# EAGLE design mod-69 (EAGLE 9.6.1)
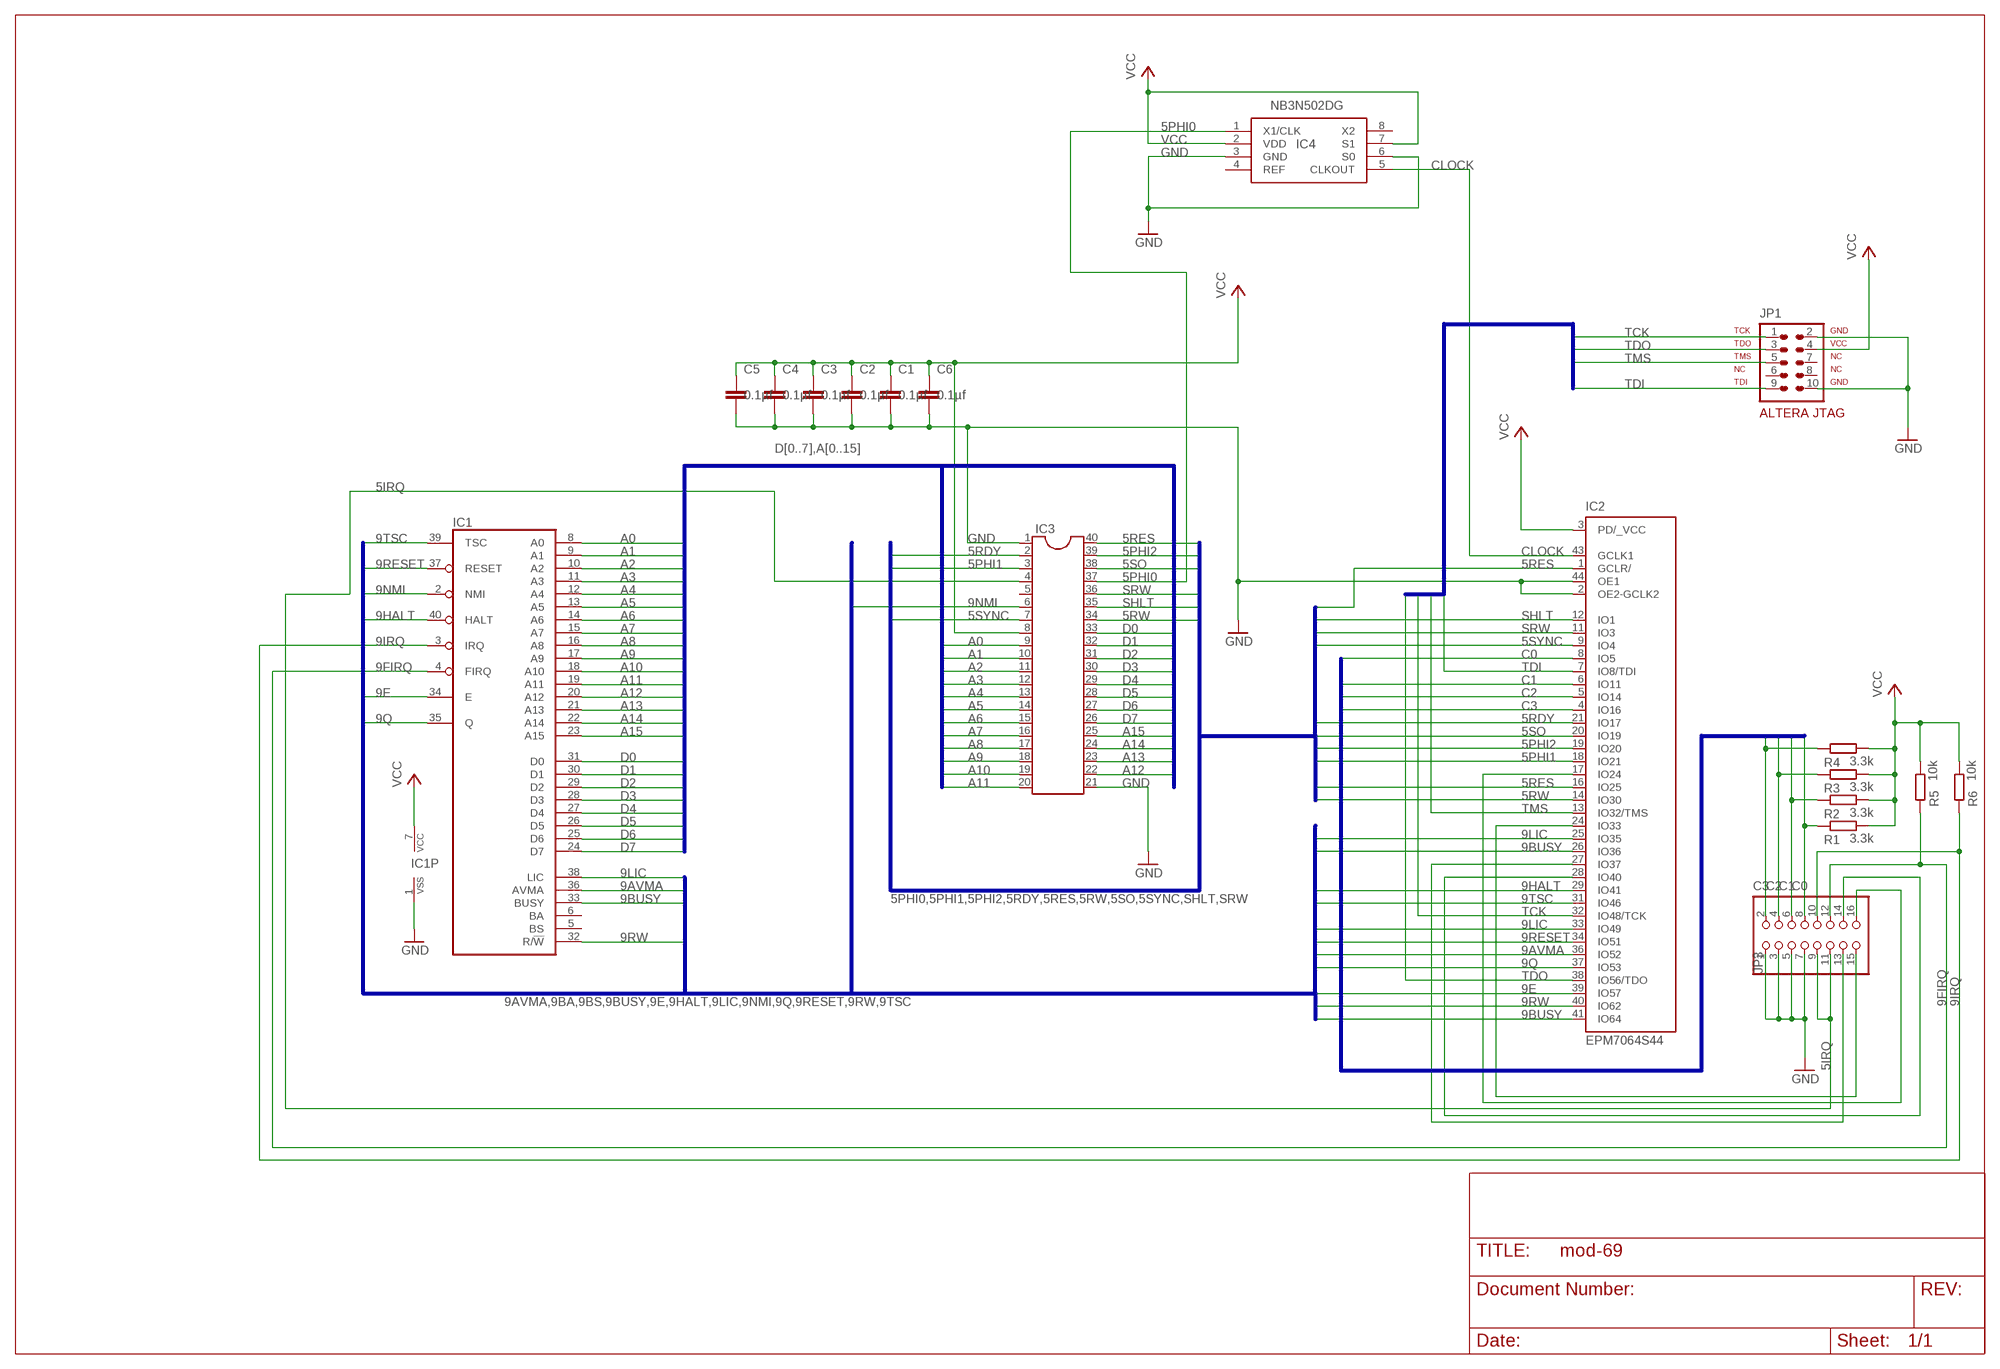
[diagram p0: schematic, sheet 1]

## Parts
C1  0.1µf  C-EUC1206  [C1206]
C2  0.1µf  C-EUC1206  [C1206]
C3  0.1µf  C-EUC1206  [C1206]
C4  0.1µf  C-EUC1206  [C1206]
C5  0.1µf  C-EUC1206  [C1206]
C6  0.1µf  C-EUC1206  [C1206]
IC1  6809E  [DIL40]
IC2  EPM7064S44  [PLCC-S44]
IC3  DIL40  [DIL40]
IC4  NB3N502DG  [SOIC127P600X175-8N]
JP1  ALTERA-JTAG-10  [ALTERA-JTAG-10]
JP3  PINHD-2X8  [2X08]
R1  3.3k  R-EU_M1206  [M1206]
R2  3.3k  R-EU_M1206  [M1206]
R3  3.3k  R-EU_M1206  [M1206]
R4  3.3k  R-EU_M1206  [M1206]
R5  10k  R-EU_M1206  [M1206]
R6  10k  R-EU_M1206  [M1206]

## Nets
5IRQ: IC3.4 JP3.9 JP3.11
5PHI0: IC3.37 IC4.1(X1/CLK)
5PHI1: IC2.18(IO21) IC3.3
5PHI2: IC2.19(IO20) IC3.39
5RDY [GND]: IC2.21(IO17) IC3.2
5RES: IC2.1(GCLR/) IC2.16(IO25) IC3.40
5RW: IC2.14(IO30) IC3.34
5SO: IC2.20(IO19) IC3.38
5SYNC: IC2.9(IO4) IC3.7
9AVMA: IC1.36(AVMA) IC2.36(IO52)
9BUSY: IC1.33(BUSY) IC2.26(IO36) IC2.41(IO64)
9E: IC1.34(E) IC2.39(IO57)
9FIRQ: IC1.4(FIRQ) JP3.12 R5.1
9HALT: IC1.40(HALT) IC2.29(IO41)
9IRQ: IC1.3(IRQ) JP3.10 R6.1
9LIC: IC1.38(LIC) IC2.25(IO35) IC2.33(IO49)
9NMI: IC1.2(NMI) IC3.6
9Q: IC1.35(Q) IC2.37(IO53)
9RESET: IC1.37(RESET) IC2.34(IO51)
9RW: IC1.32(R/!W) IC2.40(IO62)
9TSC: IC1.39(TSC) IC2.31(IO46)
A0: IC1.8(A0) IC3.9
A1: IC1.9(A1) IC3.10
A2: IC1.10(A2) IC3.11
A3: IC1.11(A3) IC3.12
A4: IC1.12(A4) IC3.13
A5: IC1.13(A5) IC3.14
A6: IC1.14(A6) IC3.15
A7: IC1.15(A7) IC3.16
A8: IC1.16(A8) IC3.17
A9: IC1.17(A9) IC3.18
A10: IC1.18(A10) IC3.19
A11: IC1.19(A11) IC3.20
A12: IC1.20(A12) IC3.22
A13: IC1.21(A13) IC3.23
A14: IC1.22(A14) IC3.24
A15: IC1.23(A15) IC3.25
C0: IC2.8(IO5) JP3.8 R1.1
C1: IC2.6(IO11) JP3.6 R2.1
C2: IC2.5(IO14) JP3.4 R3.1
C3: IC2.4(IO16) JP3.2 R4.1
CLOCK: IC2.43(GCLK1) IC4.5(CLKOUT)
D0: IC1.31(D0) IC3.33
D1: IC1.30(D1) IC3.32
D2: IC1.29(D2) IC3.31
D3: IC1.28(D3) IC3.30
D4: IC1.27(D4) IC3.29
D5: IC1.26(D5) IC3.28
D6: IC1.25(D6) IC3.27
D7: IC1.24(D7) IC3.26
GND [GND]: C1.2 C2.2 C3.2 C4.2 C5.2 C6.2 IC1.1(VSS) IC2.2(OE2-GCLK2) IC2.44(OE1) IC3.1 IC3.21 IC4.3(GND) IC4.6(S0) JP1.2(GND1) JP1.10(GND2) JP3.1 JP3.3 JP3.5 JP3.7
N$1: IC2.27(IO37) JP3.13
N$2: IC2.28(IO40) JP3.14
N$3: IC2.24(IO33) JP3.15
N$4: IC2.17(IO24) JP3.16
SHLT: IC2.12(IO1) IC3.35
SRW: IC2.11(IO3) IC3.36
TCK: IC2.32(IO48/TCK) JP1.1(TCK)
TDI: IC2.7(IO8/TDI) JP1.9(TDI)
TDO: IC2.38(IO56/TDO) JP1.3(TDO)
TMS: IC2.13(IO32/TMS) JP1.5(TMS)
VCC [PWR]: C1.1 C2.1 C3.1 C4.1 C5.1 C6.1 IC1.7(VCC) IC2.3(PD/_VCC) IC3.8 IC4.2(VDD) IC4.7(S1) JP1.4(VCC) R1.2 R2.2 R3.2 R4.2 R5.2 R6.2
Unconnected: IC1.5(BS) IC1.6(BA) IC3.5 IC4.4(REF) IC4.8(X2) JP1.6(NC1) JP1.7(NC2) JP1.8(NC3)

## Buses
D[0..7],A[0..15]
9AVMA,9BA,9BS,9BUSY,9E,9HALT,9LIC,9NMI,9Q,9RESET,9RW,9TSC
5PHI0,5PHI1,5PHI2,5RDY,5RES,5RW,5SO,5SYNC,SHLT,SRW
TDI,TDO,TMS,TCK
C[0..3]

## Power pins joined to a net without a drawn wire
GND: IC2.10(GND) IC2.22(GND) IC2.30(GND) IC2.42(GND)
VCC: IC2.15(VCC) IC2.23(VCC) IC2.35(VCC)

## Library data of the parts
C1-C6 = rcl:C-EU: CAPACITOR, European symbol; SPICEPREFIX: C
IC1 = micro-motorola:6809E: MICROCONTROLLER/MEMORY DEVICE; MF: NTE ELECTRONICS; MPN: NTE6809E; OC_FARNELL: unknown; OC_NEWARK: 31C5318
IC2 = altera:EPM7064: EPM7064 MAX 7000 family; MPN: EPM7064SLC44-10N; OC_FARNELL: 1549449; OC_NEWARK: 51R0526
IC3 = ic-package:DIL40: Dual In Line
IC4 = custom-chips:NB3N502DG: Source: Datasheet <http://www.onsemi.com/pub/Collateral/NB3N502-D.PDF>; ALLIED_NUMBER: 70347799; ALLIED_PRICE-STOCK: http://www.alliedelec.com/on-semiconductor-nb3n502dg/70347799/; HEIGHT: 1.75mm; MANUFACTURER_NAME: ON Semiconductor; MANUFACTURER_PART_NUMBER: NB3N502DG; MOUSER_PART_NUMBER: 863-NB3N502DG; MOUSER_PRICE-STOCK: https://www.mouser.com/Search/Refine.aspx?Keyword=863-NB3N502DG; RS_PART_NUMBER: 7876920P; RS_PRICE-STOCK: http://uk.rs-online.com/web/p/products/7876920P
JP1 = custom-chips:ALTERA-JTAG-10: ALTERA JTAG JTAGl Programming Header
JP3 = pinhead:PINHD-2X8: PIN HEADER
R1-R6 = rcl:R-EU_: RESISTOR, European symbol; SPICEPREFIX: R

## Net classes
0 default: width 0.152 mm, clearance 0.152 mm
1 PWR: width 0.305 mm, clearance 0.152 mm
2 GND: width 0.406 mm, clearance 0.152 mm

## Board
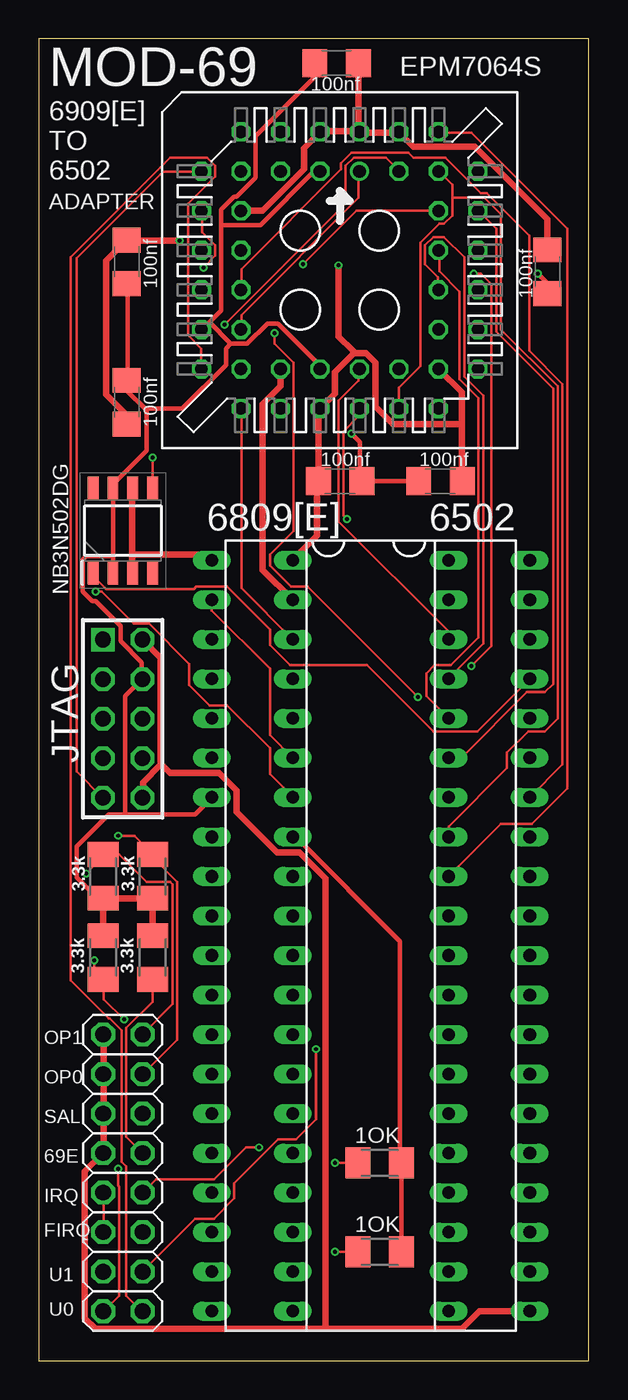
[diagram p1: board, top side]
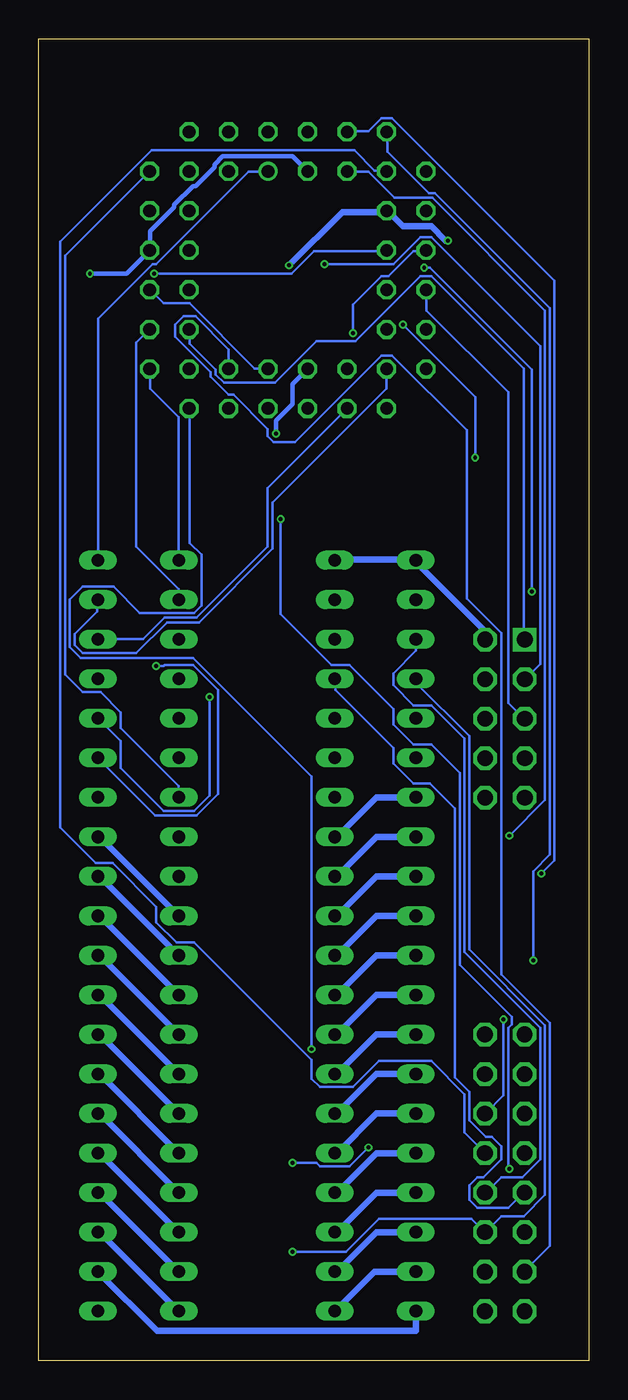
[diagram p2: board, bottom side, seen from below]

Size 35.35 x 84.94 mm. Coordinates in mm from the lower left corner, seen from the top.
Outline: 0,0 35.35,0 35.35,84.94 0,84.94 0,0
Copper layers (1*16): Top 0.035559375mm / dielectric 1.6mm / Bottom 0.035559375mm
Design rules "oshpark-2layer": minimum track width 6mil, minimum drill 10mil, track to track 6mil, track to pad 6mil, pad to pad 6mil, via to via 6mil, smd to smd 6mil, copper to edge 15mil, drill to drill 6mil, minimum pad ring 5mil, minimum via ring 5mil, stop-mask expansion 2.5mil, vias tented up to drill 0mil, thermal gap 10mil

### Footprints (pad centres in the part's own frame; a part is rotated, then mirrored left to right if it is on the bottom)
C1206 = smd 1.6 x 1.8: 1 -1.4,0; 2 1.4,0
DIL40 = drill 0.813 long: 1 -24.13,-7.62; 2 -21.59,-7.62; 3 -19.05,-7.62; 4 -16.51,-7.62; 5 -13.97,-7.62; 6 -11.43,-7.62; 7 -8.89,-7.62; 8 -6.35,-7.62; 9 -3.81,-7.62; 10 -1.27,-7.62; 11 1.27,-7.62; 12 3.81,-7.62; 13 6.35,-7.62; 14 8.89,-7.62; 15 11.43,-7.62; 16 13.97,-7.62; 17 16.51,-7.62; 18 19.05,-7.62; 19 21.59,-7.62; 20 24.13,-7.62; 21 24.13,7.62; 22 21.59,7.62; 23 19.05,7.62; 24 16.51,7.62; 25 13.97,7.62; 26 11.43,7.62; 27 8.89,7.62; 28 6.35,7.62; 29 3.81,7.62; 30 1.27,7.62; 31 -1.27,7.62; 32 -3.81,7.62; 33 -6.35,7.62; 34 -8.89,7.62; 35 -11.43,7.62; 36 -13.97,7.62; 37 -16.51,7.62; 38 -19.05,7.62; 39 -21.59,7.62; 40 -24.13,7.62
PLCC-S44 = drill 0.813: 1 1.27,6.35 | drill 0.813 octagon: 2 -1.27,8.89; 3 -1.27,6.35; 4 -3.81,8.89; 5 -3.81,6.35; 6 -6.35,8.89; 7 -8.89,6.35; 8 -6.35,6.35; 9 -8.89,3.81; 10 -6.35,3.81; 11 -8.89,1.27; 12 -6.35,1.27; 13 -8.89,-1.27; 14 -6.35,-1.27; 15 -8.89,-3.81; 16 -6.35,-3.81; 17 -8.89,-6.35; 18 -6.35,-8.89; 19 -6.35,-6.35; 20 -3.81,-8.89; 21 -3.81,-6.35; 22 -1.27,-8.89; 23 -1.27,-6.35; 24 1.27,-8.89; 25 1.27,-6.35; 26 3.81,-8.89; 27 3.81,-6.35; 28 6.35,-8.89; 29 8.89,-6.35; 30 6.35,-6.35; 31 8.89,-3.81; 32 6.35,-3.81; 33 8.89,-1.27; 34 6.35,-1.27; 35 8.89,1.27; 36 6.35,1.27; 37 8.89,3.81; 38 6.35,3.81; 39 8.89,6.35; 40 6.35,8.89; 41 6.35,6.35; 42 3.81,8.89; 43 3.81,6.35; 44 1.27,8.89
SOIC127P600X175-8N = smd 1.525 x 0.7: 1 -2.712,1.905; 2 -2.712,0.635; 3 -2.712,-0.635; 4 -2.712,-1.905; 5 2.712,-1.905; 6 2.712,-0.635; 7 2.712,0.635; 8 2.712,1.905
ALTERA-JTAG-10 = drill 1.016 square: 1 -5.08,-1.27 | drill 1.016 octagon: 2 -5.08,1.27; 3 -2.54,-1.27; 4 -2.54,1.27; 5 0,-1.27; 6 0,1.27; 7 2.54,-1.27; 8 2.54,1.27; 9 5.08,-1.27; 10 5.08,1.27
2X08 = drill 1.016 octagon: 1 -8.89,-1.27; 2 -8.89,1.27; 3 -6.35,-1.27; 4 -6.35,1.27; 5 -3.81,-1.27; 6 -3.81,1.27; 7 -1.27,-1.27; 8 -1.27,1.27; 9 1.27,-1.27; 10 1.27,1.27; 11 3.81,-1.27; 12 3.81,1.27; 13 6.35,-1.27; 14 6.35,1.27; 15 8.89,-1.27; 16 8.89,1.27
M1206 = smd 1.6 x 2: 1 -1.4,0; 2 1.4,0

### Placement (x,y rotation side)
C1  5.65,70.61 90 top
C2  32.7,69.98 90 top
C3  19.37,56.52 180 top
C4  19.14,83.39 0 top
C5  25.82,56.52 0 top
C6  5.65,61.59 270 top
IC1  18.73,27.3 270 top
IC2  19.34,70.08 0 top
IC3  23.94,27.3 270 top
IC4  5.4,53.34 90 top
JP1  5.38,41.25 270 top
JP3  5.4,12.06 270 top
R1  7.3,25.91 90 top
R2  4.13,25.91 90 top
R3  7.3,31.12 270 top
R4  4.13,31.12 270 top
R5  21.91,6.99 0 top
R6  21.91,12.7 0 top

### Tracks (layer width: path | path; a pad name or v marks a point on that pad's centre or on a via)
5IRQ
  Top 0.152: JP3.11 4.18,8.28 4.18,10.79 JP3.9
  Bottom 0.152: IC3.4 16.29,43.79 16.29,43.1 12.56,39.37 12.56,38.38 11.26,37.08 10.2,37.08 8.6,35.48 8.6,18.19 7.68,17.27 7.68,15.44 6.62,14.38 6.24,14.38 5.63,13.77 5.63,12.93 6.77,11.79 7.15,11.79 7.68,11.25 7.68,10.34 7.15,9.8 5.17,9.8 4.18,10.79 JP3.9
5PHI0
  Top 0.152: IC4.1 3.49,50.42 4.33,49.58 9.97,49.58 10.12,49.73 12.1,49.73 14.85,46.99 14.85,46 16.14,44.7 21.09,44.7 25.36,40.44 28.18,40.44 IC3.37
5PHI1
  Top 0.152: IC3.3 13.02,49.66 13.02,61.16 IC2.18
5PHI2
  Bottom 0.152: IC3.39 31.61,48.9 31.61,48.13 33.06,46.69 33.06,46 32.52,45.47 29.1,45.47 27.11,47.45 25.06,47.45 20.33,52.17 20.33,55.14 13.02,62.46 13.02,63.68 IC2.19
5RDY
  Top 0.406: IC2.21 15.53,62.61 14.39,61.47 14.39,50.8 16.29,48.9 IC3.2
5RES
  Top 0.152: IC2.16 13.02,66.27 13.02,67.18 20.56,74.73 20.56,76.4 IC2.1
  Bottom 0.152: IC3.40 31.53,51.49 31.53,66.95 28.03,70.46 27.8,70.46 21.86,76.4 20.64,76.4 IC2.1
5RW
  Top 0.152: IC3.34 33.67,38.3 33.67,62.76 31.53,64.9 31.53,72.29 28.79,75.03 28.41,75.03 26.12,77.32 24.07,77.32 23.76,77.62 20.1,77.62 19.42,76.94 19.42,76.56 13.02,70.16 13.02,68.86 IC2.14
5SO
  Bottom 0.152: IC3.38 31.53,46.38 28.64,46.38 27.27,47.75 25.21,47.75 20.64,52.32 20.64,56.06 15.53,61.16 IC2.20
5SYNC  (via drill 0.25)
  Top 0.152: v10.58,70.23 11.34,70.99 11.34,71.68 10.5,72.52 10.5,73.89 IC2.9 | v3.64,49.43 4.03,49.43 6.08,47.37 7.07,47.37 9.66,44.78 9.66,43.41 10.96,42.11 12.1,42.11 14.85,39.37 14.85,37.69 16.29,36.25 IC3.7
  Bottom 0.152: v10.58,70.23 10.2,70.23 3.64,63.68 v3.64,49.43
9AVMA
  Top 0.152: IC1.36 24.9,42.72 24.9,44.17 25.44,44.7 26.5,44.7 28.26,46.46 28.26,61.85 27.04,63.07 27.04,68.71 25.74,70 25.74,71.3 IC2.36
9BUSY
  Top 0.152: IC2.26 23.15,62.53 24.52,63.91 24.52,71.83 25.74,73.05 26.05,73.05 26.58,73.58 26.58,74.73 | 26.58,74.73 26.58,75.56 25.74,76.4 IC2.41 | IC1.33 26.35,34.34 30.09,38.08 30.09,39.07 31.46,40.44 32.52,40.44 33.36,41.28 33.36,62.61 29.71,66.27 29.71,73.66 28.64,74.73 26.58,74.73
9E
  Bottom 0.152: IC1.34 26.35,36.93 30.09,40.66 30.09,41.66 31.38,42.95 32.52,42.95 33.67,44.09 33.67,70.99 IC2.39
9FIRQ  (via drill 0.25)
  Top 0.152: v19.04,6.99 R5.1
  Bottom 0.152: IC1.4 11.11,43.56 7.68,40.13 7.68,26.42 2.81,21.54 2.81,10.64 4.18,9.27 5.63,9.27 6.62,8.28 JP3.12 7.53,9.12 13.47,9.12 15.61,6.99 v19.04,6.99
9HALT
  Bottom 0.152: IC1.40 26.35,60.63 28.18,62.46 28.18,63.68 IC2.29
9IRQ  (via drill 0.25)
  Top 0.152: v19.04,12.7 R6.1 | v14.16,13.69 13.32,13.69 11.26,11.63 7.53,11.63 6.69,10.79 JP3.10
  Bottom 0.152: IC1.3 11.11,45.62 12.56,44.17 12.56,43.41 11.26,42.11 10.12,42.11 7.99,39.98 7.99,26.26 3.11,21.39 3.11,12.93 4.25,11.79 5.63,11.79 6.62,10.79 JP3.10 | v19.04,12.7 17.51,12.7 17.28,12.47 15.38,12.47 v14.16,13.69
9LIC
  Top 0.152: IC1.38 26.35,46.84 19.27,53.92 19.27,61.7 20.56,62.99 20.56,63.68 IC2.25
  Bottom 0.152: IC2.25 20.64,63.75 21.48,63.75 25.67,67.95 27.34,67.95 28.18,68.78 IC2.33
9NMI
  Top 0.152: IC1.2 11.11,48.21 14.85,44.48 14.85,40.21 IC3.6
9Q
  Top 0.152: IC1.35 26.35,38.76 27.19,38.76 31.38,42.95 32.52,42.95 33.06,43.48 33.06,62.46 29.4,66.12 29.4,72.75 28.26,73.89 IC2.37
9RESET
  Top 0.152: IC2.34 25.67,68.86 25.67,69.62 24.83,70.46 24.83,71.68 25.36,72.21 26.05,72.21 27.34,70.92 27.34,63.22 28.56,62 28.56,46.08 26.35,43.87 IC1.37
9RW
  Top 0.152: IC2.40 25.74,78.92 27.8,78.92 33.97,72.75 33.97,36.78 31.69,34.49 29.71,34.49 26.35,31.14 IC1.32
9TSC
  Bottom 0.152: IC1.39 26.35,49.58 29.1,52.32 29.1,65.43 28.26,66.27 IC2.31
A0
  Bottom 0.406: IC3.9 16.19,31.12 13.65,33.66 IC1.8
A1
  Bottom 0.406: IC3.10 16.19,28.58 13.65,31.12 IC1.9
A2
  Bottom 0.406: IC3.11 16.19,26.04 13.65,28.58 IC1.10
A3
  Bottom 0.406: IC3.12 16.19,23.5 13.65,26.04 IC1.11
A4
  Bottom 0.406: IC3.13 16.19,20.96 13.65,23.5 IC1.12
A5
  Bottom 0.406: IC3.14 16.19,18.41 13.65,20.96 IC1.13
A6
  Bottom 0.406: IC3.15 16.19,15.88 13.65,18.41 IC1.14
A7
  Bottom 0.406: IC3.16 16.19,13.33 13.65,15.88 IC1.15
A8
  Bottom 0.406: IC3.17 16.19,10.79 13.65,13.33 IC1.16
A9
  Bottom 0.406: IC3.18 16.19,8.26 13.65,10.79 IC1.17
A10
  Bottom 0.406: IC3.19 16.19,5.72 13.65,8.26 IC1.18
A11
  Bottom 0.406: IC3.20 13.78,5.72 IC1.19
A12
  Bottom 0.406: IC1.20 11.11,1.91 27.75,1.91 IC3.22
A13
  Bottom 0.406: IC1.21 31.43,8.26 IC3.23
A14
  Bottom 0.406: IC1.22 31.43,10.79 IC3.24
A15
  Bottom 0.406: IC1.23 31.43,13.33 IC3.25
C0
  Top 0.152: R1.1 7.3,23.06 5.63,21.39 5.63,14.38 JP3.8
  Bottom 0.152: IC2.8 13.02,76.48 13.78,76.48 15.07,77.78 28.11,77.78 33.97,71.91 33.97,34.27 31.69,31.98 30.62,31.98 27.8,29.16 27.8,28.17 26.5,26.87 25.36,26.87 17.82,19.33 17.82,18.11 17.28,17.58 15.15,17.58 13.47,19.25 10.12,19.25 7.99,17.12 7.99,14.68 6.69,13.39 JP3.8
C1  (via drill 0.25)
  Top 0.152: v5.47,21.92 4.18,23.22 4.18,24.44 R2.1 4.1,24.51 3.57,25.04 v3.57,25.73
  Bottom 0.152: v5.47,21.92 5.47,17.04 6.62,15.9 JP3.6 | v3.57,25.73 3.57,31.45 2.5,32.51 2.5,67.64 9.89,75.03 10.27,75.03 12.94,77.7 12.94,78.92 IC2.6
C2  (via drill 0.25)
  Top 0.152: JP3.4 6.69,18.41 8.9,20.62 8.9,30.76 7.3,32.36 R3.1 7.3,32.59 6.16,33.73 v5.09,33.73
  Bottom 0.152: v5.09,33.73 2.81,36.02 2.81,67.49 10.05,74.73 12.48,74.73 14.16,76.4 15.53,76.4 IC2.5
C3  (via drill 0.25)
  Top 0.152: JP3.2 6.69,21.01 8.6,22.91 8.6,30.61 8.45,30.76 6.92,30.76 5.17,32.51 4.18,32.51 R4.1 4.18,32.44 v3.04,31.29
  Bottom 0.152: v3.04,31.29 2.2,32.13 2.2,69.39 12.64,79.83 13.32,79.83 14.16,78.99 15.53,78.99 IC2.4
CLOCK  (via drill 0.25)
  Top 0.152: v7.3,58.04 IC4.5 | v11.95,66.57 19.72,74.35 19.72,76.78 20.26,77.32 22.31,77.32 23.15,76.48 IC2.43
  Bottom 0.152: v7.3,58.04 7.3,61.92 v11.95,66.57
D0
  Bottom 0.406: IC1.31 31.43,33.66 IC3.33
D1
  Bottom 0.406: IC1.30 31.43,31.12 IC3.32
D2
  Bottom 0.406: IC1.29 31.43,28.58 IC3.31
D3
  Bottom 0.406: IC1.28 31.43,26.04 IC3.30
D4
  Bottom 0.406: IC1.27 31.43,23.5 IC3.29
D5
  Bottom 0.406: IC1.26 31.43,20.96 IC3.28
D6
  Bottom 0.406: IC1.25 31.43,18.41 IC3.27
D7
  Bottom 0.406: IC1.24 31.43,15.88 IC3.26
GND  (via drill 0.25)
  Top 0.406: C2.2 32.68,71.45 32.68,73.36 28.03,78 24.07,78 23.15,78.92 IC2.42 23,78.92 20.79,78.92 IC2.44 | C6.2 5.63,60.25 5.63,60.78 4.33,62.08 4.33,70.69 5.63,71.98 C1.2 5.85,71.98 v9.06,71.98 | C4.2 20.56,83.34 20.56,78.99 IC2.44 | IC2.10 14.39,73.89 17.06,76.56 17.06,77.93 18.05,78.92 IC2.2 18.28,78.99 20.41,78.99 IC2.44 | IC3.21 28.33,3.18 27.19,2.03 18.43,2.03 | 18.43,2.03 3.64,2.03 2.96,2.72 2.96,12.17 JP3.7 4.18,13.46 4.18,15.82 JP3.5 4.18,16.05 4.18,18.41 JP3.3 4.18,18.57 4.18,20.93 JP3.1 | 7.84,38.3 6.69,37.16 6.69,36.17 JP1.10 | 7.84,38.3 7.84,45.16 6.69,46.3 JP1.2 | 27.19,60.17 27.19,62.23 IC2.30 | 27.19,60.17 27.19,56.52 C5.2 | 6.01,51.79 6.01,55.98 IC4.6 | 6.01,51.79 6.01,50.65 IC4.3 | 6.01,51.79 10.81,51.79 11.11,51.49 IC1.1 | IC3.1 17.89,53.01 17.89,56.36 C3.2 17.97,61.09 IC2.22 19.04,62.15 19.04,63.53 20.26,64.75 | 27.19,60.17 22.77,60.17 21.63,61.32 21.63,64.14 21.02,64.75 20.26,64.75 | 18.43,2.03 18.43,30.99 16.75,32.66 15.3,32.66 12.71,35.26 12.71,36.63 11.57,37.77 8.45,37.77 7.99,38.23 7.84,38.3 | v19.27,70.38 19.27,65.81 20.18,64.9 20.26,64.75
  Bottom 0.406: v9.06,71.98 9.21,71.98 10.12,72.9 11.95,72.9 12.94,73.89 IC2.10 13.17,73.81 15.84,73.81 v19.27,70.38 | IC3.1 16.29,51.49 11.11,51.49 IC1.1 11.04,51.26 6.69,46.91 6.69,46.38 JP1.2
N$1
  Bottom 0.152: IC2.27 23.15,64.97 25.29,67.11 26.05,67.11 26.58,66.57 26.58,65.81 24.3,63.53 24.3,63.22 23.15,62.08 22.85,62.08 20.64,59.87 20.64,59.41 20.26,59.03 18.88,59.03 13.32,64.59 12.64,64.59 7.84,59.79 7.84,48.97 5.63,46.76 5.63,24.82 2.5,21.69 2.5,7.37 4.1,5.77 JP3.13
N$2  (via drill 0.25)
  Top 0.152: v17.82,20.02 17.82,15.52 16.52,14.22 15.38,14.22 12.56,11.4 12.56,10.41 11.26,9.12 10.05,9.12 6.69,5.77 JP3.14
  Bottom 0.152: v17.82,20.02 17.82,37.54 25.44,45.16 32.68,45.16 33.36,45.85 33.36,48.9 32.52,49.73 30.54,49.73 28.87,48.06 25.36,48.06 24.9,48.51 24.9,51.79 25.67,52.55 25.67,61.16 IC2.28
N$3  (via drill 0.25)
  Top 0.152: v19.8,54.08 19.57,54.31 19.57,59.72 20.56,60.71 20.56,61.16 IC2.24 | v5.09,12.32 5.09,11.25 5.17,11.18 5.17,4.17 4.18,3.18 JP3.15
  Bottom 0.152: v19.8,54.08 19.8,47.98 16.52,44.7 15.38,44.7 12.56,41.89 12.56,40.89 11.26,39.6 10.12,39.6 8.29,37.77 8.29,25.43 4.94,22.07 4.94,21.62 5.17,21.39 5.17,12.4 v5.09,12.32
N$4
  Top 0.152: IC2.17 10.43,63.75 10.43,65.05 9.59,65.89 9.59,74.35 11.34,76.1 11.34,76.78 10.81,77.32 8.45,77.32 2.04,70.92 2.04,24.44 4.48,22 4.56,22 5.32,21.23 5.32,12.78 5.63,12.47 5.63,4.17 6.62,3.18 JP3.16
SHLT  (via drill 0.25)
  Top 0.152: v27.95,69.85 28.41,69.85 29.1,69.16 29.1,45.92 v27.8,44.63
  Bottom 0.152: v27.95,69.85 19.11,69.85 17.67,71.3 13.02,71.3 IC2.12 | v27.8,44.63 27.34,44.63 27.27,44.7 25.44,44.7 23.84,43.1 23.84,36.4 25.21,35.03 27.88,35.03 31.53,38.68 IC3.35
SRW  (via drill 0.25)
  Top 0.152: v15.15,66.04 15.15,65.35 16.37,64.14 16.37,53.31 14.85,51.79 14.85,51.11 16.22,49.73 17.28,49.73 v24.37,42.65
  Bottom 0.152: v15.15,66.04 15.15,67.87 13.32,69.7 12.87,69.7 11.26,71.3 10.5,71.3 IC2.11 | v24.37,42.65 24.37,36.32 25.36,35.33 27.34,35.33 30.09,38.08 30.09,39.83 31.53,41.28 IC3.36
TCK
  Bottom 0.152: IC2.32 25.67,66.27 25.67,65.35 23.99,63.68 23.99,63.37 23.46,62.84 20.18,62.84 17.51,65.51 15,65.51 10.81,69.7 10.12,69.7 4.18,63.75 4.18,46.38 JP1.1
TDI
  Top 0.152: IC2.7 10.43,76.4 7.99,76.4 2.43,70.84 2.43,37.85 JP1.9
TDO  (via drill 0.25)
  Top 0.152: IC2.38 20.41,73.89 v16.98,70.46
  Bottom 0.152: v16.98,70.46 12.56,70.46 10.81,72.21 10.12,72.21 3.11,65.2 3.11,44.78 JP1.3
TMS
  Bottom 0.152: IC2.13 10.43,68.78 10.43,67.49 5.17,62.23 5.17,42.27 4.18,41.28 JP1.5
VCC  (via drill 0.25)
  Top 0.305: 5.55,35.1 10.05,35.1 11.11,36.17 IC1.7 | 5.55,35.1 4.48,35.1 2.43,33.05 2.43,31.06 3.72,29.77 3.95,29.77 R4.2 | C1.1 5.7,69.16 5.7,63.07 C6.1 5.63,62.84 5.63,62.38 6.92,61.09 | 4.79,51.71 4.79,55.98 IC4.7 4.86,56.13 4.86,56.44 6.92,58.5 6.92,61.09 | 4.79,51.71 4.79,50.65 IC4.2 | 4.79,51.71 3.04,51.71 2.81,51.49 2.81,49.43 3.42,48.82 3.64,48.82 5.25,47.22 5.25,46.23 6.62,44.86 6.62,43.79 JP1.4 6.54,43.71 5.55,42.72 5.55,35.1 | v32.07,69.85 32.68,69.24 32.68,68.63 C2.1 | C5.1 C3.1 20.64,56.59 20.64,59.03 v20.1,59.56 | 11.72,72.97 11.72,67.49 10.96,66.73 | 11.72,72.97 11.72,73.97 12.56,74.8 12.71,74.8 13.93,76.02 13.93,78.69 17.67,82.42 17.67,83.34 C4.1 | 10.96,66.73 10.5,66.27 IC2.15 | 12.33,65.35 13.4,65.35 14.69,66.65 15.38,66.65 18.05,63.98 18.05,63.75 IC2.23 | 10.96,66.73 12.33,65.35 | 11.72,72.97 14.24,72.97 17.67,76.4 18.05,76.4 IC2.3 | 12.33,65.35 12.03,65.05 12.03,63.98 9.21,61.16 7,61.16 6.92,61.09 | R5.2 R6.2 23.23,12.78 23.23,26.95 16.52,33.66 IC3.8
  Top 0.406: R2.2 R4.2 R3.2 R1.2
  Bottom 0.305: v32.07,69.85 29.71,69.85 28.26,71.3 IC2.35 28.18,71.45 28.18,72.59 26.66,74.12 26.66,74.27 25.44,75.49 25.29,75.49 24.07,76.71 24.07,76.86 23.53,77.39 19.04,77.39 IC2.3 | v20.1,59.56 20.1,60.4 19.04,61.47 19.04,62.76 IC2.23
  Bottom 0.406: IC3.8 16.19,33.66 13.65,36.2 IC1.7

### Text on the board
tPlace: EPM7064S | MOD-69 | 100nf | 6909[E] | TO | 6502 | ADAPTER | 100nf | 100nf | 100nf | 100nf | 100nf | 6809[E] | 6502 | NB3N502DG | JTAG | OP1 | OP0 | SAL | 1OK | 69E | IRQ | FIRQ | 1OK | U1 | U0